# Altium schematic sheet System.SchDoc: System Schematic
size B; Date: [Date]; Engineer: Ted Fernau; SheetNumber: 1; SheetTotal: 1
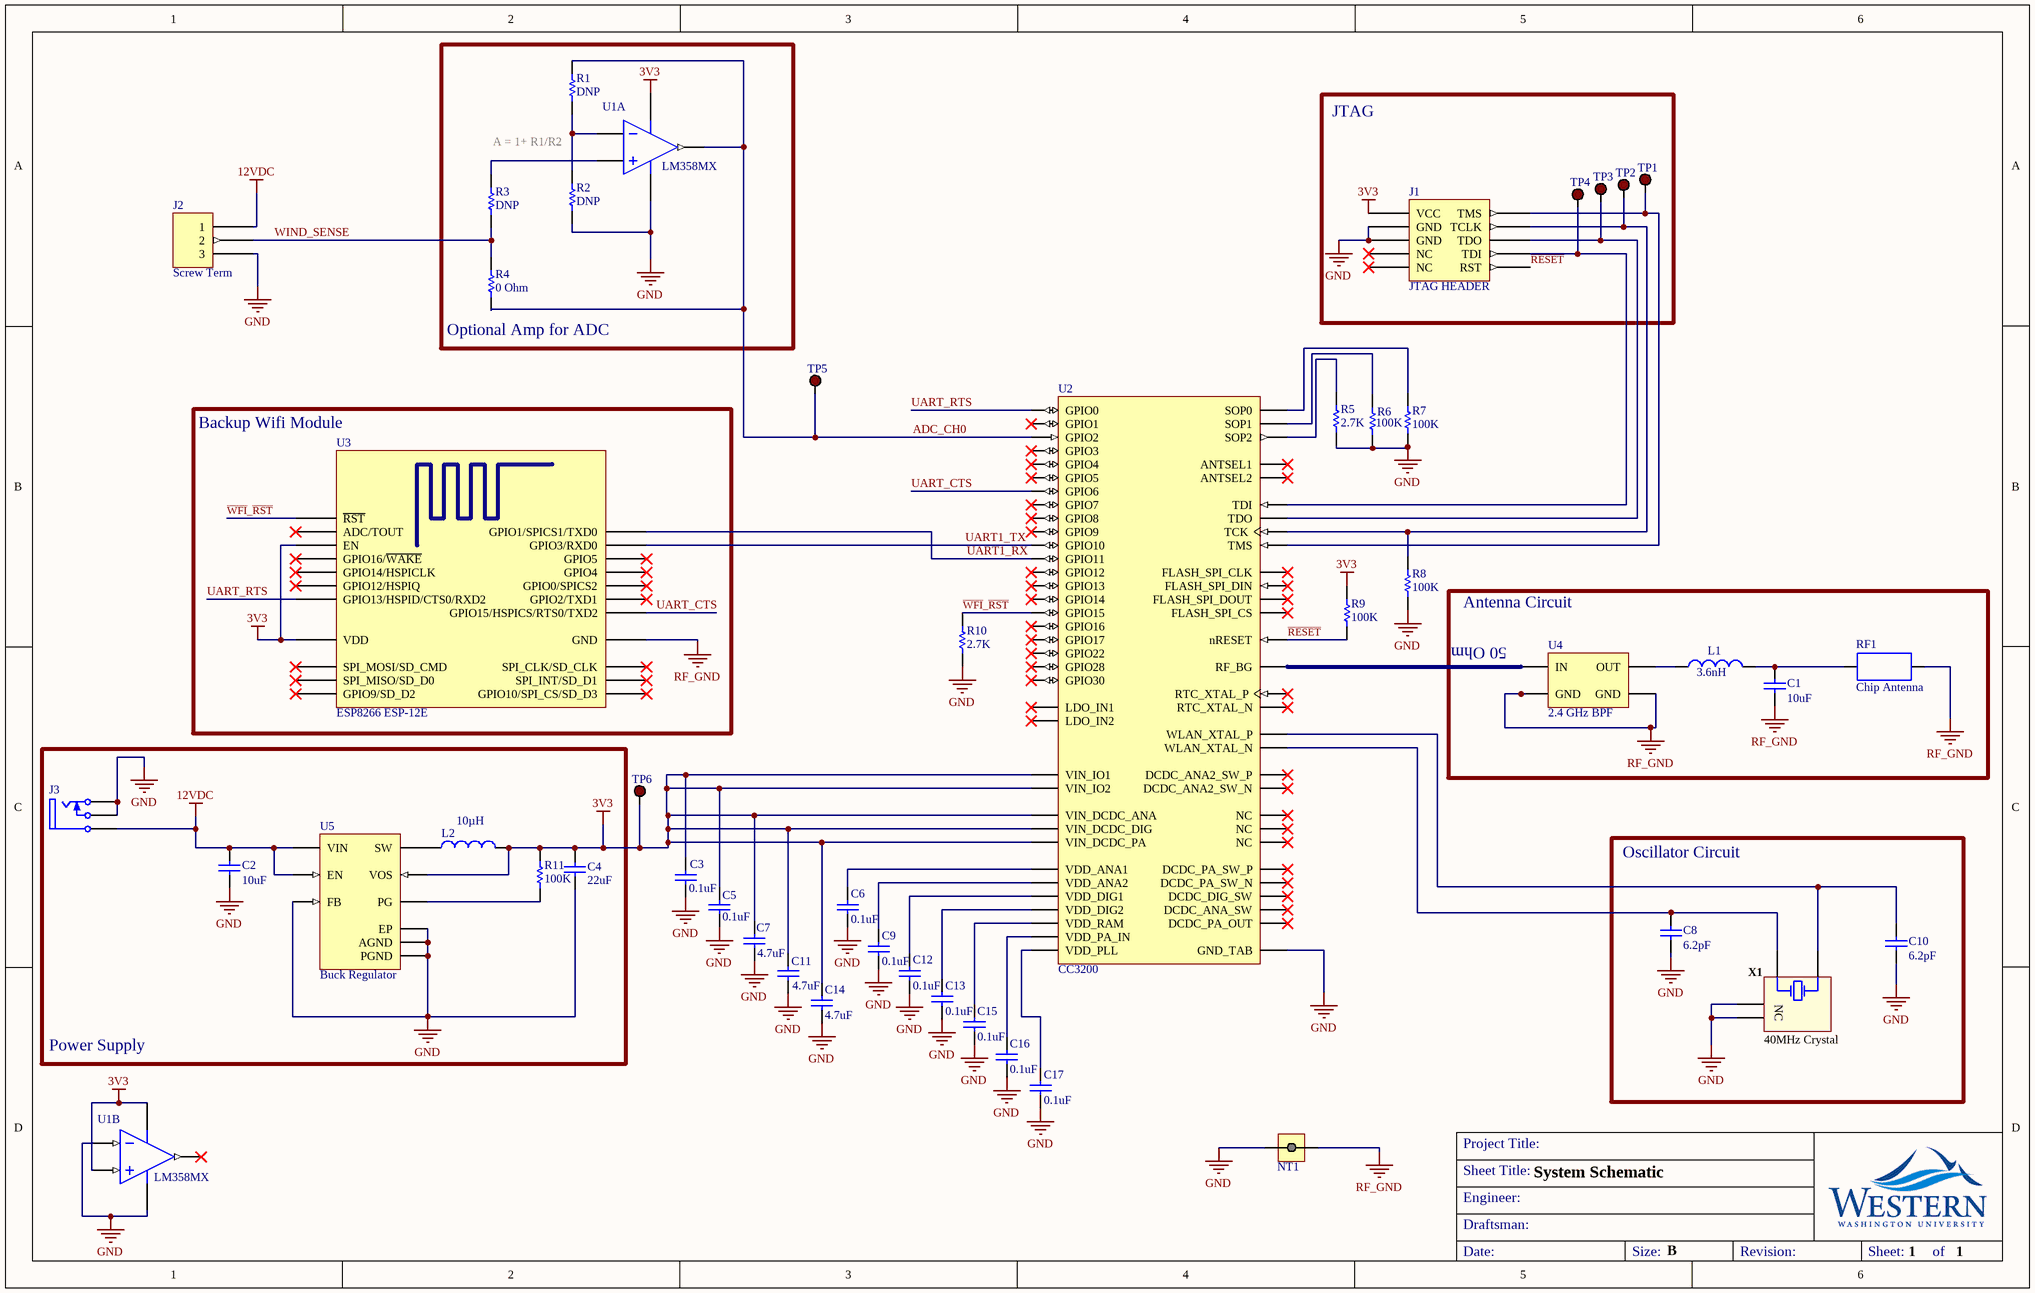
[diagram p0: System.SchDoc]

## Parts
C1  value 10uF  [CAPC0603(1608)100_M]  (hidden comment: CAP 10uF 10V 0603(1608))
C2  value 10uF  [CAPC0603(1608)100_M]  (hidden comment: CAP 10uF 10V 0603(1608))
C3  value 0.1uF  [CAPC0603(1608)100_M]  (hidden comment: CAP 10uF 10V 0603(1608))
C4  22uF  [CAPC0603(1608)100_L]
C5  value 0.1uF  [CAPC0603(1608)100_M]  (hidden comment: CAP 10uF 10V 0603(1608))
C6  value 0.1uF  [CAPC0603(1608)100_M]  (hidden comment: CAP 10uF 10V 0603(1608))
C7  value 4.7uF  [CAPC0603(1608)100_M]  (hidden comment: CAP 10uF 10V 0603(1608))
C8  value 6.2pF  [CAPC0603(1608)100_M]  (hidden comment: CAP 10uF 10V 0603(1608))
C9  value 0.1uF  [CAPC0603(1608)100_M]  (hidden comment: CAP 10uF 10V 0603(1608))
C10  value 6.2pF  [CAPC0603(1608)100_M]  (hidden comment: CAP 10uF 10V 0603(1608))
C11  value 4.7uF  [CAPC0603(1608)100_M]  (hidden comment: CAP 10uF 10V 0603(1608))
C12  value 0.1uF  [CAPC0603(1608)100_M]  (hidden comment: CAP 10uF 10V 0603(1608))
C13  value 0.1uF  [CAPC0603(1608)100_M]  (hidden comment: CAP 10uF 10V 0603(1608))
C14  value 4.7uF  [CAPC0603(1608)100_M]  (hidden comment: CAP 10uF 10V 0603(1608))
C15  value 0.1uF  [CAPC0603(1608)100_M]  (hidden comment: CAP 10uF 10V 0603(1608))
C16  value 0.1uF  [CAPC0603(1608)100_M]  (hidden comment: CAP 10uF 10V 0603(1608))
C17  value 0.1uF  [CAPC0603(1608)100_M]  (hidden comment: CAP 10uF 10V 0603(1608))
J1  JTAG HEADER  [FTSH-105-01-L-DV-K]
J2  Screw Term  [SCREW TERM 3 PIN 3.5mm]
J3  RASM722X  [SWIT-RASM722X_V]  (value not drawn)
L1  Inductance: 3.6nH  [TDK-IND0805-125_V]  (hidden comment: MLZ2012N100LT)
L2  Inductance: 10µH  [TDK-IND0805-125_V]  (hidden comment: MLZ2012N100LT)
NT1  NET TIE 0603  [NetTie0603]  (value not drawn)  (net tie, no BOM)
R1  DNP  [RESC0603(1608)_N]
R2  DNP  [RESC0603(1608)_N]
R3  DNP  [RESC0603(1608)_N]
R4  0 Ohm  [RESC0603(1608)_N]
R5  2.7K  [RESC0805(2012)_L]
R6  100K  [RESC0805(2012)_L]
R7  100K  [RESC0805(2012)_L]
R8  100K  [RESC0805(2012)_L]
R9  100K  [RESC0805(2012)_L]
R10  2.7K  [RESC0805(2012)_L]
R11  100K  [RESC0805(2012)_L]
RF1  Chip Antenna  [TAYO-AH316M-2_N]
TP1  5001  [Keystone_5001]  (value not drawn)
TP2  5001  [Keystone_5001]  (value not drawn)
TP3  5001  [Keystone_5001]  (value not drawn)
TP4  5001  [Keystone_5001]  (value not drawn)
TP5  5001  [Keystone_5001]  (value not drawn)
TP6  5001  [Keystone_5001]  (value not drawn)
U1  LM358MX  [M08A_L]  (parts A,B of 2)
U2  CC3200  [TI-RGC64-7300x7300TP_L]
U3  ESP8266 ESP-12E  [ESP8266 ESP-12-E]
U4  2.4 GHz BPF  [TDK-DEA202450BT-1294C1-H_V]
U5  Buck Regulator  [DSG0008A_V]
X1  40MHz Crystal  [AVX-CX3225GB-4_V]

## Blocks framed on the sheet
Optional Amp for ADC: R1-R4 U1
JTAG: J1 TP1-TP4
Backup Wifi Module: U3
Power Supply: C2 C4 J3 L2 R11 U5
Oscillator Circuit: C8 C10 X1

## Nets
3V3: C3.1 C4.2 C5.1 C7.2 C11.2 C14.2 J1.1(VCC) L2.2 R9.2 R11.2 TP6.1(TP) U1.5(INB+) U1.8(V+) U2.10(VIN_IO1) U2.37(VIN_DCDC_ANA) U2.39(VIN_DCDC_PA) U2.44(VIN_DCDC_DIG) U2.54(VIN_IO2) U3.3(EN) U3.8(VDD) U5.6(VOS)
12VDC: C2.2 J2.1 J3.1(SLEEVE) U5.2(VIN) U5.3(EN)
GND: C2.1 C3.2 C4.1 C5.2 C6.1 C7.1 C8.1 C9.1 C10.1 C11.1 C12.1 C13.1 C14.1 C15.1 C16.1 C17.1 J1.3(GND) J1.5(GND) J2.3 J3.2(TIP) J3.3(SHUNT) NT1.1 R2.1 R5.1 R6.1 R7.1 R8.1 R10.1 U1.4(GND) U1.6(INB-) U2.65(GND_TAB) U5.1(PGND) U5.4(AGND) U5.5(FB) U5.9(EP) X1.2(NC) X1.4(NC)
RF_GND: C1.1 NT1.2 RF1.2 U3.15(GND) U4.2(GND) U4.4(GND)
ADC_CH0: R1.2 R4.1 TP5.1(TP) U1.1(OUTA) U2.57(GPIO2)
~{RESET}: J1.10(RST) R9.1 U2.32(nRESET)
UART1_RX: U2.2(GPIO11) U3.22(GPIO1/SPICS1/TXD0)
UART1_TX: U2.1(GPIO10) U3.21(GPIO3/RXD0)
UART_CTS: U2.61(GPIO6) U3.16(GPIO15/HSPICS/RTS0/TXD2)
UART_RTS: U2.50(GPIO0) U3.7(GPIO13/HSPID/CTS0/RXD2)
~{WFI}_~{RST}: R10.2 U2.6(GPIO15) U3.1(~{RST})
WIND_SENSE: J2.2 R3.1 R4.2
NetC1_2: C1.2 L1.2 RF1.1
NetC6_2: C6.2 U2.48(VDD_ANA1)
NetC8_2: C8.2 U2.22(WLAN_XTAL_N) X1.3(HOT)
NetC9_2: C9.2 U2.47(VDD_ANA2)
NetC10_2: C10.2 U2.23(WLAN_XTAL_P) X1.1(HOT)
NetC12_2: C12.2 U2.9(VDD_DIG1)
NetC13_2: C13.2 U2.56(VDD_DIG2)
NetC15_2: C15.2 U2.49(VDD_RAM)
NetC16_2: C16.2 U2.33(VDD_PA_IN)
NetC17_2: C17.2 U2.24(VDD_PLL)
NetJ1_2: J1.2(TMS) TP1.1(TP) U2.20(TMS)
NetJ1_4: J1.4(TCLK) R8.2 TP2.1(TP) U2.19(TCK)
NetJ1_6: J1.6(TDO) TP3.1(TP) U2.17(TDO)
NetJ1_8: J1.8(TDI) TP4.1(TP) U2.16(TDI)
NetL1_1: L1.1 U4.3(OUT)
NetL2_1: L2.1 U5.7(SW)
NetR1_1: R1.1 R2.2 U1.2(INA-)
NetR3_2: R3.2 U1.3(INA+)
NetR5_2: R5.2 U2.21(SOP2)
NetR6_2: R6.2 U2.34(SOP1)
NetR7_2: R7.2 U2.35(SOP0)
NetR11_1: R11.1 U5.8(PG)
NetU2_31: U2.31(RF_BG) U4.1(IN)

Not connected (* = marked no-connect by the designer): J1 7(NC)* 9(NC)*; U1 7(OUTB)*; U2 3(GPIO12)* 4(GPIO13)* 5(GPIO14)* 7(GPIO16)* 8(GPIO17)* 11(FLASH_SPI_CLK)* 12(FLASH_SPI_DOUT)* 13(FLASH_SPI_DIN)* 14(FLASH_SPI_CS)* 15(GPIO22)* 18(GPIO28)* 25(LDO_IN2)* 26(NC)* 27(NC)* 28(NC)* 29(ANTSEL1)* 30(ANTSEL2)* 36(LDO_IN1)* 38(DCDC_ANA_SW)* 40(DCDC_PA_SW_P)* 41(DCDC_PA_SW_N)* 42(DCDC_PA_OUT)* 43(DCDC_DIG_SW)* 45(DCDC_ANA2_SW_P)* 46(DCDC_ANA2_SW_N)* 51(RTC_XTAL_P)* 52(RTC_XTAL_N)* 53(GPIO30)* 55(GPIO1)* 58(GPIO3)* 59(GPIO4)* 60(GPIO5)* 62(GPIO7)* 63(GPIO8)* 64(GPIO9)*; U3 2(ADC/TOUT)* 4(GPIO16/~{WAKE})* 5(GPIO14/HSPICLK)* 6(GPIO12/HSPIQ)* 9(SPI_MOSI/SD_CMD)* 10(SPI_MISO/SD_D0)* 11(GPIO9/SD_D2)* 12(GPIO10/SPI_CS/SD_D3)* 13(SPI_INT/SD_D1)* 14(SPI_CLK/SD_CLK)* 17(GPIO2/TXD1)* 18(GPIO0/SPICS2)* 19(GPIO4)* 20(GPIO5)*

## Notes on the sheet
- A = 1+ R1/R2
- Antenna Circuit
- (near U4) 50 Ohm
- Sheet Title:
- Project Title:
- Engineer:
- Draftsman:
- Date:
- Size:
- B
- Revision:
- Sheet:        of

## Library data of the parts
C1-C3 C5-C17 = CMP-1035-02800-1: CAP 10uF 10V ±20% 0603 (1608 Metric) Thickness 1mm SMD; Tolerance: Â±20%; Case-EIA: 0603; Case-Metric: 1608; Max Thickness: 1 mm; Rated Voltage: 10 V; Technology: SMT
C4 = CMP-1590-00005-1: 0603 (1608 Metric) Chip Capacitor; Case-Metric: 1608; Case-EIA: 0603; PackageReference: CAPC0603(1608)100
J1 = JTAG 10 PIN HEADER: 10 pin 0.05" pitch header for JTAG; Supplier 1: Digi-Key; Supplier Part Number 1: FTSH-105-01-L-DV-K-TR-ND
J2 = SCREW TERM 3.5mm 3pos: Supplier 1: Digi-Key; Supplier Part Number 1: ED2741-ND
J3 = CMP-1772-00002-1: Power Jack, 5 A, 250 V, 3-Pin SMD, RoHS, Bulk; ComponentLink1URL: http://www.switchcraft.com/; ComponentLink2URL: http://www.switchcraft.com/Drawings/rasm732x_cd.pdf; ComponentLink1Description: Manufacturer URL; PackageReference: RASM722X; ComponentLink2Description: Datasheet; DatasheetVersion: Rev. A, 09/2005; PackageDescription: 3-Pin Surface Mount Device, Body 14.5 x 9 mm
L1 L2 = CMP-0266-00001-1: Multilayer Inductor, 10 uH, ±20%, 300 mOhm, 50MHz, 0805(2012); Manufacturer: TDK Corporation; Manufacturer Part Number: MLZ2012N100LTD25; DC Resistance: 0.3 Ohm; Material - Core: Ferrite; Current Rating: 500mA; Current - Saturation: 110mA; Shielding: Shielded; DC Resistance (DCR): 390 mOhm Max; Frequency - Test: 2MHz; PackageReference: IND0805-125; ComponentLink1URL: http://www.global.tdk.com/; DatasheetVersion: 05/2013; ComponentLink2Description: Datasheet; ComponentLink1Description: Manufacturer URL; Mounting Technology: Suface Mount; ComponentLink2URL: http://www.tdk.co.jp/tcfx01/c533_mlz.pdf; PartNumber: MLZ2012N100LT; PackageDescription: 2-Pin SMT Inductor, 2 x 1.25 mm Body; Supplier 1: Digi-Key; Supplier Part Number 1: 445-16376-1-ND; RoHS: RoHS Compliant; Category: Inductors, Coils, Chokes; Stock 1: 1160; Pricing 1: 1=0.18, 10=0.163, 50=0.1268, 100=0.1138, 500=0.0975, 1000=0.0845 (USD); Packaging: Cut Tape (CT); Part Status: Active; Type: Multilayer; Tolerance: ±20%; Q @ Freq: -; Frequency - Self Resonant: -; Ratings: AEC-Q200; Operating Temperature: -55°C ~ 125°C; Mounting Type: Surface Mount; Package / Case: 0805 (2012 Metric); Supplier Device Package: 0805 (2012 Metric); Size / Dimension: 0.079" L x 0.049" W (2.00mm x 1.25mm); Height - Seated (Max): 0.041" (1.05mm); ComponentLink3URL: https://product.tdk.com/info/en/catalog/datasheets/inductor_automotive_decoupling_mlz2012_en.pdf; ComponentLink3Description: https://product.tdk.com/info/en/catalog/datasheets/inductor_automotive_decoupling_mlz2012_en.pdf
NT1 = NET TIE
R1-R4 = CMP-1012-00001-1: Jumper 0603 (1608 Metric); Case-Metric: 1608; Value: 0.00 Ohm; Power: None; Case-EIA: 0603; Technology: SMT; Tolerance: None
R5-R11 = CMP-1013-00122-1: 100K 0.125W 5% 0805 (2012 Metric)  SMD; Case-Metric: 2012; Value: 100000.00 Ohm; Case-EIA: 0805; Tolerance: 5 %; Technology: SMT; Power: 0.125 W
RF1 = CMP-1660-00004-1: Chip Antenna, 2.4 to 2.5 GHz, -40 to 85 degC, 2-Pin SMD, Pb-Free, Tape and Reel; Resistance: 2.1 Ohm; Tolerance: 10%; Current Rating: 140 mA; Case\Package: 1210; Shielding: Unshielded; ComponentLink1Description: Manufacturer URL; Height: 2.2 mm; RoHSCompliant: true; ComponentLink1URL: http://www.t-yuden.com/; Width: 0.098 inch; Max Operating Temperature: 100 degC; REACH SVHC: No SVHC; DatasheetVersion: Sep-15; Packaging: Tape and Reel; ComponentLink2Description: Datasheet; Case Code (Metric): 3225; PackageReference: AH316M-2; Length: 0.126 inch; Radiation Hardening: No; Mount: Surface Mount; Package Quantity: 1; Min Operating Temperature: -20 degC; Case Code (Imperial): 1210; ComponentLink2URL: http://www.yuden.co.jp/productdata/catalog/en/chipantenna01_e.pdf; Pins: 2; PackageDescription: 2-Pin Surface Mount Device, Body 3.2 x 1.6 mm
TP1-TP6 = TEST POINT: TEST POINT PC MINI .040"D BLACK; Manufacturer: Keystone Electronics; Supplier 1: Digi-Key; Manufacturer Part Number: 5001; RoHS: RoHS Compliant; Category: Test and Measurement; Stock 1: 7538; Pricing 1: 1=0.34, 10=0.315, 50=0.2296, 100=0.2206, 250=0.19812, 500=0.1891, 1000=0.15759, 2500=0.14408, 5000=0.13508 (USD); Packaging: Bulk; Type: PC Test Point, Miniature; Terminal: 0.010" x 0.020" (0.25mm x 0.51mm) Phosphor Bronze Wire, Silver Plated; Mounting Type: 0.040" (1.02mm) Hole Diameter; Material: Base, Nylon 46, UL 94V-0; Color: Black; ComponentLink1URL: http://www.keyelco.com/product-pdf.cfm?p=1310; ComponentLink1Description: http://www.keyelco.com/product-pdf.cfm?p=1310; Supplier Part Number 1: 5001K-ND
U1 = CMP-0055-00630-1: Low Power Dual Operational Amplifier, 8-pin Narrow SOIC; Manufacturer: National Semiconductor; PackageTopMarking: NSZXTT*LM*358M; CompType: Amplifiers; PowerWise: N; PinCount: 8; RoHS: N; Code_JEDEC: MS-012-AA; DatasheetVersion: Oct-2005; PackageDescription: SOIC Narrow, 4.9 x 3.9 x 1.45mm, 8 Lead, 1.27mm Pitch; PackageVersion: revM, May-2009; PackageReference: M08A; Code_IPC: SOIC127P600-8; PartId: 1
U2 = CMP-1530-00002-1: SimpleLink Wi-Fi and Internet-of-Things Solution, a Single-Chip Wireless MCU, 2.1 to 3.6 V, -40 to 85 degC, 64-Pin PQFN (RGC64), Green (RoHS & no Sb/Br), Tray; PartNumber: CC3200R1M2RGC; Manufacturer: Texas Instruments; Peak Calibration Current@VBAT: 2.1 V=670 mA Typ.; RAM: 256 kB Max.; Sensitivity@1 DSSS: -95.7 dBm; RF Family/Standard: WiFi; Protocol: 802.11b/g/n; Modulation: DSSS, OFDM; Frequency: 2.4GHz; Data Rate (Max): 54Mbps; Power - Output: 18.3dBm; Sensitivity: -95.7dBm; Memory Size: 256kB RAM, 64kB ROM; Serial Interfaces: I²C, I²S, JTAG, SPI, UART; GPIO: 27; Voltage - Supply: 2.1 V ~ 3.6 V; Current - Receiving: 53mA ~ 59mA; PackageDescription: 64-Pin Plastic Quad Flatpack No-Lead, Body 9 x 9 mm, Pitch 0.5 mm; ComponentLink1Description: Manufacturer URL; DatasheetVersion: SWAS032F; Temperature Range: -40 to 85 degC; Mounting Technology: Surface Mount; ComponentLink2Description: Datasheet; ComponentLink3Description: Package Specification; ComponentLink2URL: http://www.ti.com/lit/ds/symlink/cc3200.pdf; RoHS: TRUE; Packing: Tray; VBAT: 2.1 to 3.6 V; ComponentLink3URL: http://www.ti.com/lit/ml/mpqf125e/mpqf125e.pdf; ComponentLink1URL: www.ti.com; PackageVersion: 4204106/F; Supplier 1: Digi-Key; Supplier Part Number 1: 296-38012-ND; Manufacturer Part Number: CC3200R1M2RGC; Category: RF/IF and RFID; Stock 1: 1853; Pricing 1: 1=12.16, 10=11.175, 100=9.4377, 500=8.3955, 1000=7.7007, 2500=7.4112, 5000=7.2375 (USD); Packaging: Tray; Part Status: Active; Type: TxRx + MCU; Current - Transmitting: 53mA ~ 59mA; Operating Temperature: -40°C ~ 85°C; Package / Case: 64-VFQFN Exposed Pad
U3 = ESP8266 ESP-12-E
U4 = CMP-1663-00013-1: 2.4 GHz Filter; Case\Package: 0603; Resistance: 22 kohm; Tolerance: 1%; Voltage Rating: 75 V; Power Rating: 100 mW; Width: 0.8 mm; Height: 0.45 mm; Case Code (Metric): 1608; DatasheetVersion: Jun-15; Length: 1.6 mm; ComponentLink2URL: https://product.tdk.com/info/en/documents/data_sheet/rf_bpf_dea202450bt-1294c1-h_en.pdf; Package Quantity: 5000; Max Operating Temperature: 155 degC; Case Code (Imperial): 0603; ComponentLink2Description: Datasheet; Min Operating Temperature: -55 degC; Pins: 2; Radiation Hardening: No; Mount: Surface Mount; Packaging: Tape and Reel; PackageDescription: 4-Pin Surface Mount Device, Body 2 x 1.25 mm; ComponentLink1Description: Manufacturer URL; ComponentLink1URL: http://www.tdk.com/; PackageReference: DEA202450BT-1294C1-H; REACH SVHC: Yes; RoHSCompliant: true
U5 = CMP-0323-00337-3: Buck Step Down Regulator with 3 to 17 V Input and 3.3 V Output, -40 to 85 degC, 8-Pin WSON (DSG), Green (RoHS & no Sb/Br); Manufacturer: Texas Instruments; PartNumber: TPS62172DSGR; Vout(Max)(V): 3.3; Iq(Typ)(mA): 0.017; Switch Current Limit(Typ)(A): 1.05; Regulated Outputs(#): 1; Vin(Min)(V): 3; Duty Cycle(Max)(%): 100; Iout(Max)(A): 0.5; Synchronous Rectification: TRUE; SubFamily: Step-Down Regulator; Rating: Catalog; Vin(Max)(V): 17; Function: Step-Down; Output Configuration: Positive; Output Type: Fixed; Voltage - Input (Min): 3V; Voltage - Input (Max): 17V; Voltage - Output (Min/Fixed): 3.3V; Current - Output: 500mA; Frequency - Switching: 2.25MHz; Synchronous Rectifier: Yes; Eco-Plan: Green (RoHS & no Sb/Br); ComponentLink1URL: http://www.ti.com/general/docs/lit/getliterature.tsp?genericPartNumber=TPS62172&fileType=pdf; Code_JEDEC: MO-229; ComponentLink3Description: URL Link1; ComponentLink2URL: http://www.ti.com/litv/pdf/mpds308a; Mounting Technology: Surface Mount; Preset Vout(V): 3.3; ComponentLink1Description: Datasheet; PackageVersion: revB, Oct-2010; PackageReference: DSG0008A; Topology: Buck; DatasheetVersion: SLVSAT8A; ComponentLink3URL: Samples URL:http://www.ti.com/product/tps62172#samples; PackageDescription: 8-Pin Plastic Small Outline No-Lead, 2 x 2 x 0.8 mm Body, 0.5 mm Pitch, Exposed Pad; ComponentLink2Description: Package Specification; Vout(Min)(V): 3.3; Supplier 1: Digi-Key; Supplier Part Number 1: 296-39449-1-ND; Manufacturer Part Number: TPS62172DSGR; RoHS: RoHS Compliant; Category: Integrated Circuits (ICs); Stock 1: 15892; Pricing 1: 1=1.56, 10=1.395, 100=1.0878, 500=0.89964, 1000=0.57375 (USD); Packaging: Cut Tape (CT); Part Status: Active; Number of Outputs: 1; Voltage - Output (Max): -; Operating Temperature: -40°C ~ 85°C (TA); Mounting Type: Surface Mount; Package / Case: 8-WFDFN Exposed Pad; Supplier Device Package: 8-WSON (2x2); ComponentLink4URL: http://www.ti.com/lit/ds/symlink/tps62171.pdf; ComponentLink4Description: http://www.ti.com/lit/ds/symlink/tps62171.pdf
X1 = CMP-0614-00001-1: Crystal Unit, 8 pF, 25000 kHz, -10 to 70 degC, 4-Pin 3.2 x 2.5 x 0.8 mm SMD, RoHS, Tape and Reel; Manufacturer: Kyocera; PartNumber: CX3225GB25000D0HEQCC; Load Capacitance: 8 pF; Frequency Tolerance: +/- 20 x 10^(-6); Operationg Temperature: -10 to 70 degC; PackageDescription: 4-Pin SMT, Body 3.2 x 2.5 mm, Height 0.9 mm; PackageVersion: Sep-13; PackageReference: CX3225GB-4; ComponentLink2Description: Datasheet; Series: CX3225GB; DatasheetVersion: Sep-13; ComponentLink2URL: http://global.kyocera.com/prdct/electro/pdf/xtal/cx3225gb_cs_e.pdf; ComponentLink3Description: Package Specification; ComponentLink1URL: http://global.kyocera.com/; ComponentLink3URL: http://global.kyocera.com/prdct/electro/pdf/xtal/cx3225gb_cs_e.pdf; Mounting Technology: Surface Mount; Frequency: 25000 kHz; Packing: Tape and Reel; ComponentLink1Description: Manufacturer URL; RoHS: TRUE